# EAGLE design SenseThermo TEC - CR2ERP (EAGLE 9.3.2)
LICENSE: CERN OHL v1.2; REV: CR2ERP; TITLE: SenseTemp TEC; URL: https://github.com/CapableRobot/SenseTemp-TEC

## Sheet 1 of 4
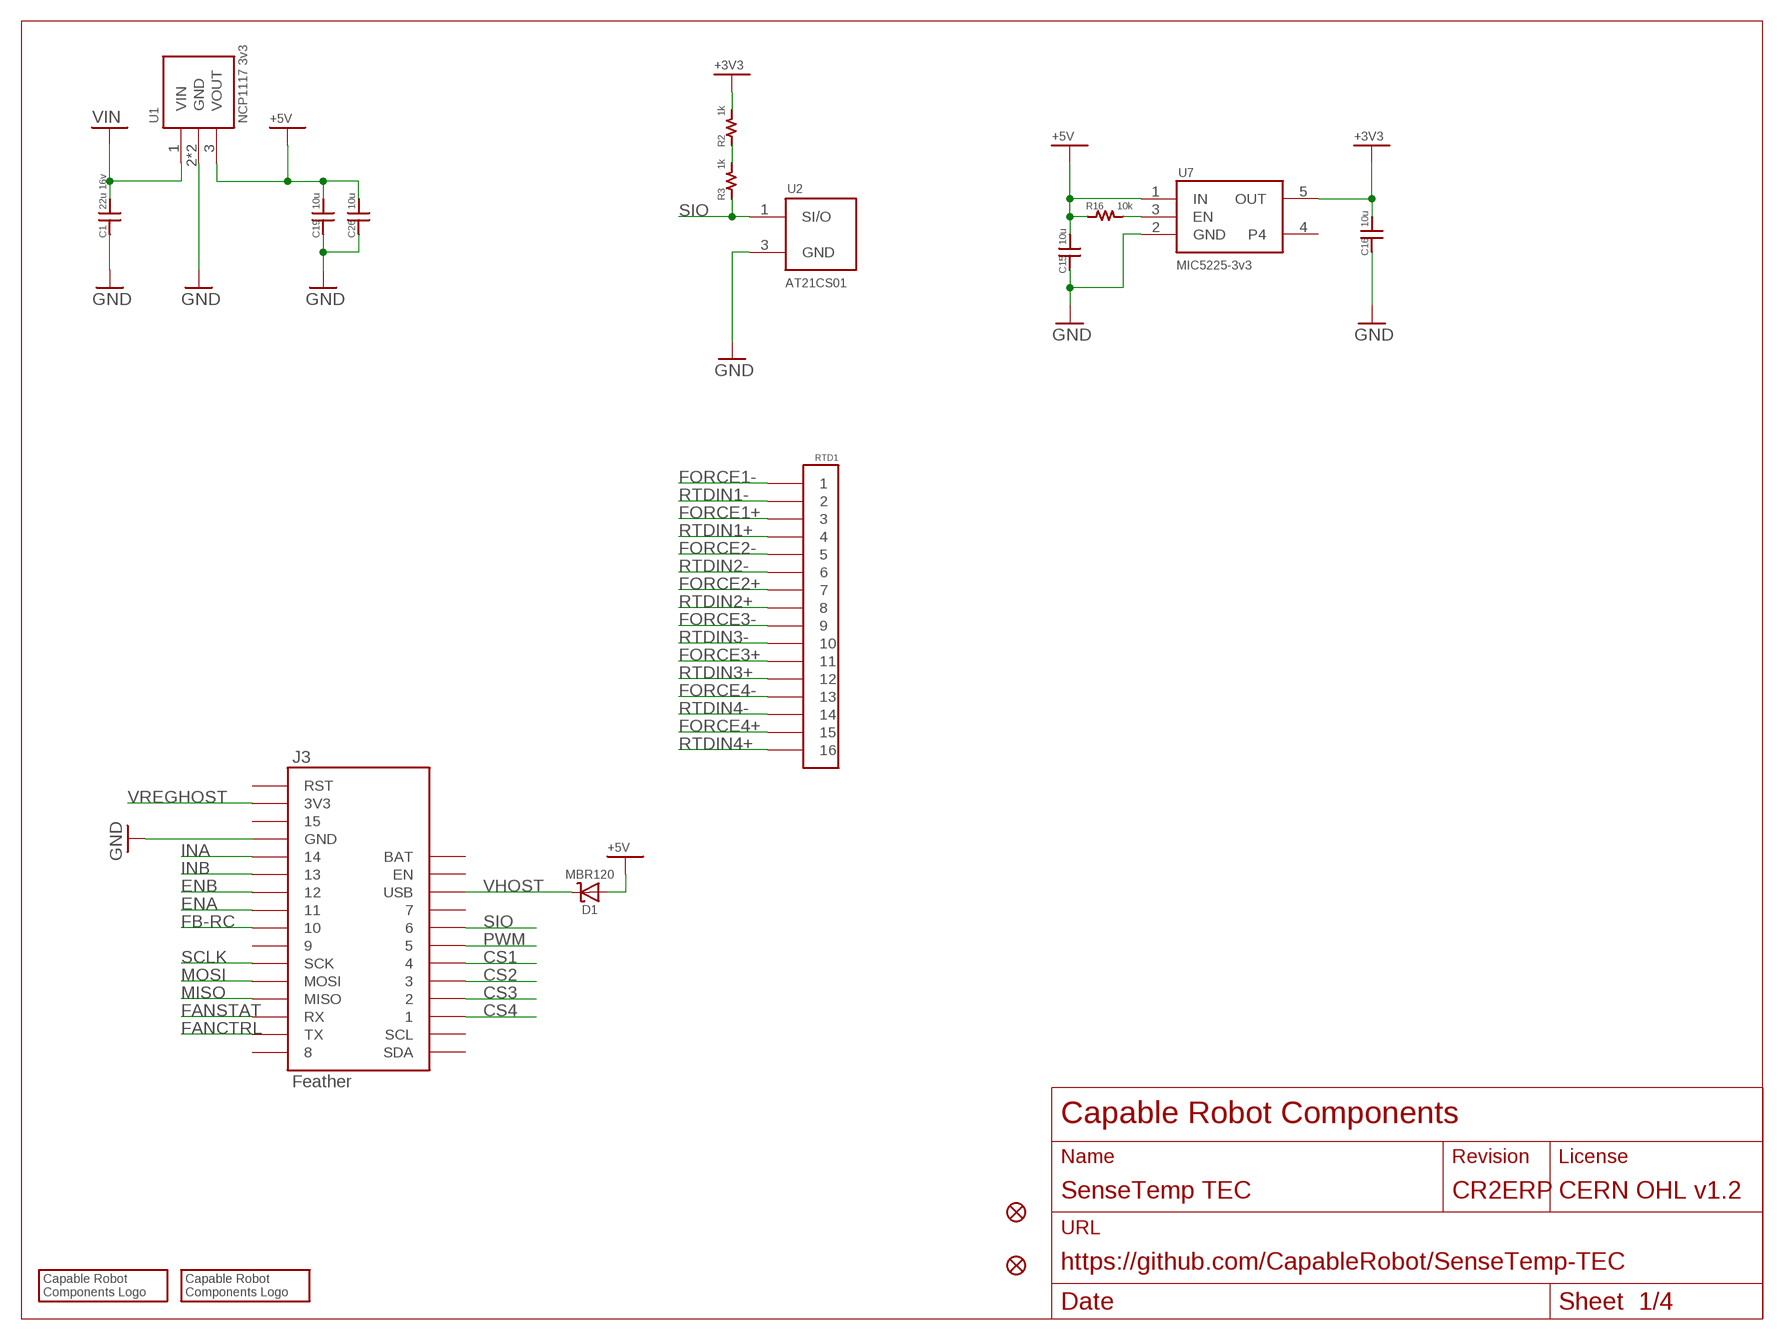
[diagram p0: schematic, sheet 1]

### Parts
C1  22u 16v  CAP1206  [1206]
C15  10u  CAP0805  [0805]
C16  10u  CAP0805  [0805]
C19  10u  CAP0805  [0805]
C26  10u  CAP0805  [0805]
D1  MBR120  DIODE-SCHOTTKYSOD-123  [SOD-123]
FID1  FIDUCIAL""  [FIDUCIAL_1MM]
FID2  FIDUCIAL""  [FIDUCIAL_1MM]
J3  FEATHERPTH  [FEATHER-PTH]
LOGO1  CRC-LOGO7SILK  [CRC-LOGO-7-SILK]
LOGO2  CRC-LOGO5  [CRC-LOGO-5]
R2  1k  RES0603  [0603]
R3  1k  RES0603  [0603]
R16  10k  RES0603  [0603]
RTD1  CONN-16ZT  [CONN-2X8-050-SMT-ZT]
U1  NCP1117 3v3  VREG-LDO  [SOT230P700X180-4]
U2  AT21CS01  [SOT23]
U7  3v3  MIC5225  [SOT25]

### Nets
+3V3: C16.P$2 R2.2 U7.5(OUT) ; also sheet 2,3
+5V: C15.P$2 C19.P$2 C26.P$2 D1.A R16.1 U1.3(VOUT) U7.1(IN)
CS1: J3.4 ; also sheet 2
CS2: J3.3 ; also sheet 2
CS3: J3.2 ; also sheet 3
CS4: J3.1 ; also sheet 3
ENA: J3.11 ; also sheet 4
ENB: J3.12 ; also sheet 4
FANCTRL: J3.TX ; also sheet 4
FANSTAT: J3.RX ; also sheet 4
FB-RC: J3.10 ; also sheet 4
FORCE1+: RTD1.3 ; also sheet 2
FORCE1-: RTD1.1 ; also sheet 2
FORCE2+: RTD1.7 ; also sheet 2
FORCE2-: RTD1.5 ; also sheet 2
FORCE3+: RTD1.11 ; also sheet 3
FORCE3-: RTD1.9 ; also sheet 3
FORCE4+: RTD1.15 ; also sheet 3
FORCE4-: RTD1.13 ; also sheet 3
GND: C1.P$1 C15.P$1 C16.P$1 C19.P$1 C26.P$1 J3.GND U1.2(GND) U1.4(GND) U2.3(GND) U7.2(GND) ; also sheet 2,3,4
INA: J3.14 ; also sheet 4
INB: J3.13 ; also sheet 4
MISO: J3.MISO ; also sheet 2,3
MOSI: J3.MOSI ; also sheet 2,3
N$4: R2.1 R3.2
N$20: R16.2 U7.3(EN)
PWM: J3.5 ; also sheet 4
RTDIN1+: RTD1.4 ; also sheet 2
RTDIN1-: RTD1.2 ; also sheet 2
RTDIN2+: RTD1.8 ; also sheet 2
RTDIN2-: RTD1.6 ; also sheet 2
RTDIN3+: RTD1.12 ; also sheet 3
RTDIN3-: RTD1.10 ; also sheet 3
RTDIN4+: RTD1.16 ; also sheet 3
RTDIN4-: RTD1.14 ; also sheet 3
SCLK: J3.SCK ; also sheet 2,3
SIO: J3.6 R3.1 U2.1(SI/O)
VHOST: D1.C J3.USB
VIN: C1.P$2 U1.1(VIN) ; also sheet 4
VREGHOST: J3.3V3 ; also sheet 4
Unconnected: J3.7 J3.8 J3.9 J3.15 J3.BAT J3.EN J3.RST J3.SCL J3.SDA U7.4

## Sheet 2 of 4
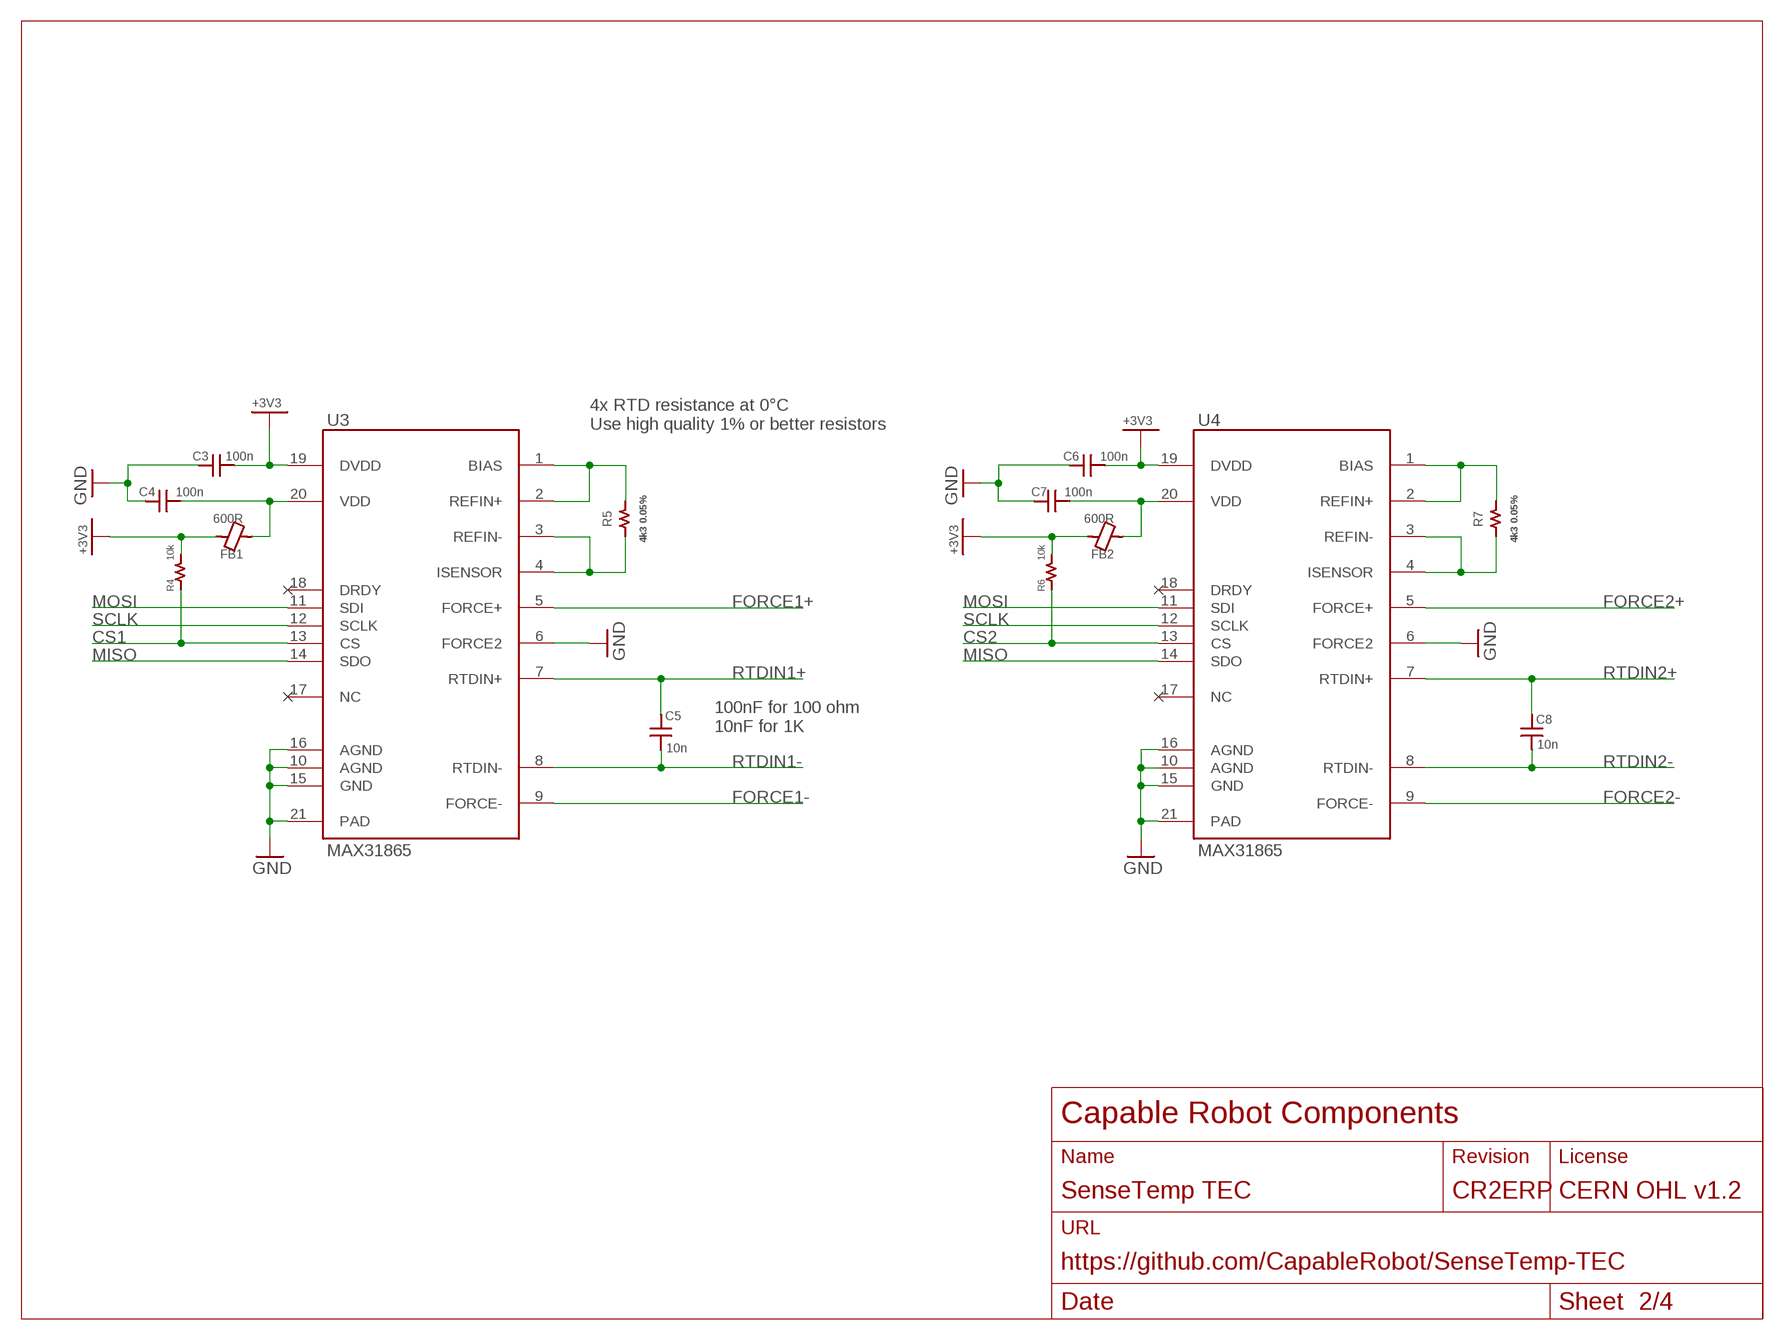
[diagram p1: schematic, sheet 2]

### Parts
C3  100n  CAP0603  [0603]
C4  100n  CAP0603  [0603]
C5  10n  CAP0603  [0603]
C6  100n  CAP0603  [0603]
C7  100n  CAP0603  [0603]
C8  10n  CAP0603  [0603]
FB1  600R  FER0603  [0603]
FB2  600R  FER0603  [0603]
R4  10k  RES0603  [0603]
R5  4k3 0.05%  RES0603  [0603]
R6  10k  RES0603  [0603]
R7  4k3 0.05%  RES0603  [0603]
U3  MAX31865  [QFN65P500X500X100-21T325]
U4  MAX31865  [QFN65P500X500X100-21T325]

### Nets
+3V3: C3.1 C6.1 FB1.2 FB2.2 R4.2 R6.2 U3.19(DVDD) U4.19(DVDD) ; also sheet 1,3
CS1: R4.1 U3.13(CS) ; also sheet 1
CS2: R6.1 U4.13(CS) ; also sheet 1
FORCE1+: U3.5(FORCE+) ; also sheet 1
FORCE1-: U3.9(FORCE-) ; also sheet 1
FORCE2+: U4.5(FORCE+) ; also sheet 1
FORCE2-: U4.9(FORCE-) ; also sheet 1
GND: C3.2 C4.2 C6.2 C7.2 U3.6(FORCE2) U3.10(AGND) U3.15(GND) U3.16(AGND) U3.21(PAD) U4.6(FORCE2) U4.10(AGND) U4.15(GND) U4.16(AGND) U4.21(PAD) ; also sheet 1,3,4
MISO: U3.14(SDO) U4.14(SDO) ; also sheet 1,3
MOSI: U3.11(SDI) U4.11(SDI) ; also sheet 1,3
N$5: R5.2 U3.1(BIAS) U3.2(REFIN+)
N$6: R5.1 U3.3(REFIN-) U3.4(ISENSOR)
N$7: C4.1 FB1.1 U3.20(VDD)
N$8: R7.2 U4.1(BIAS) U4.2(REFIN+)
N$9: R7.1 U4.3(REFIN-) U4.4(ISENSOR)
N$10: C7.1 FB2.1 U4.20(VDD)
RTDIN1+: C5.1 U3.7(RTDIN+) ; also sheet 1
RTDIN1-: C5.2 U3.8(RTDIN-) ; also sheet 1
RTDIN2+: C8.1 U4.7(RTDIN+) ; also sheet 1
RTDIN2-: C8.2 U4.8(RTDIN-) ; also sheet 1
SCLK: U3.12(SCLK) U4.12(SCLK) ; also sheet 1,3
Unconnected: U3.17(NC) U3.18(DRDY) U4.17(NC) U4.18(DRDY)

### Notes on the sheet
- 4x RTD resistance at 0°C 
  Use high quality 1% or better resistors
- 100nF for 100 ohm
  10nF for 1K

## Sheet 3 of 4
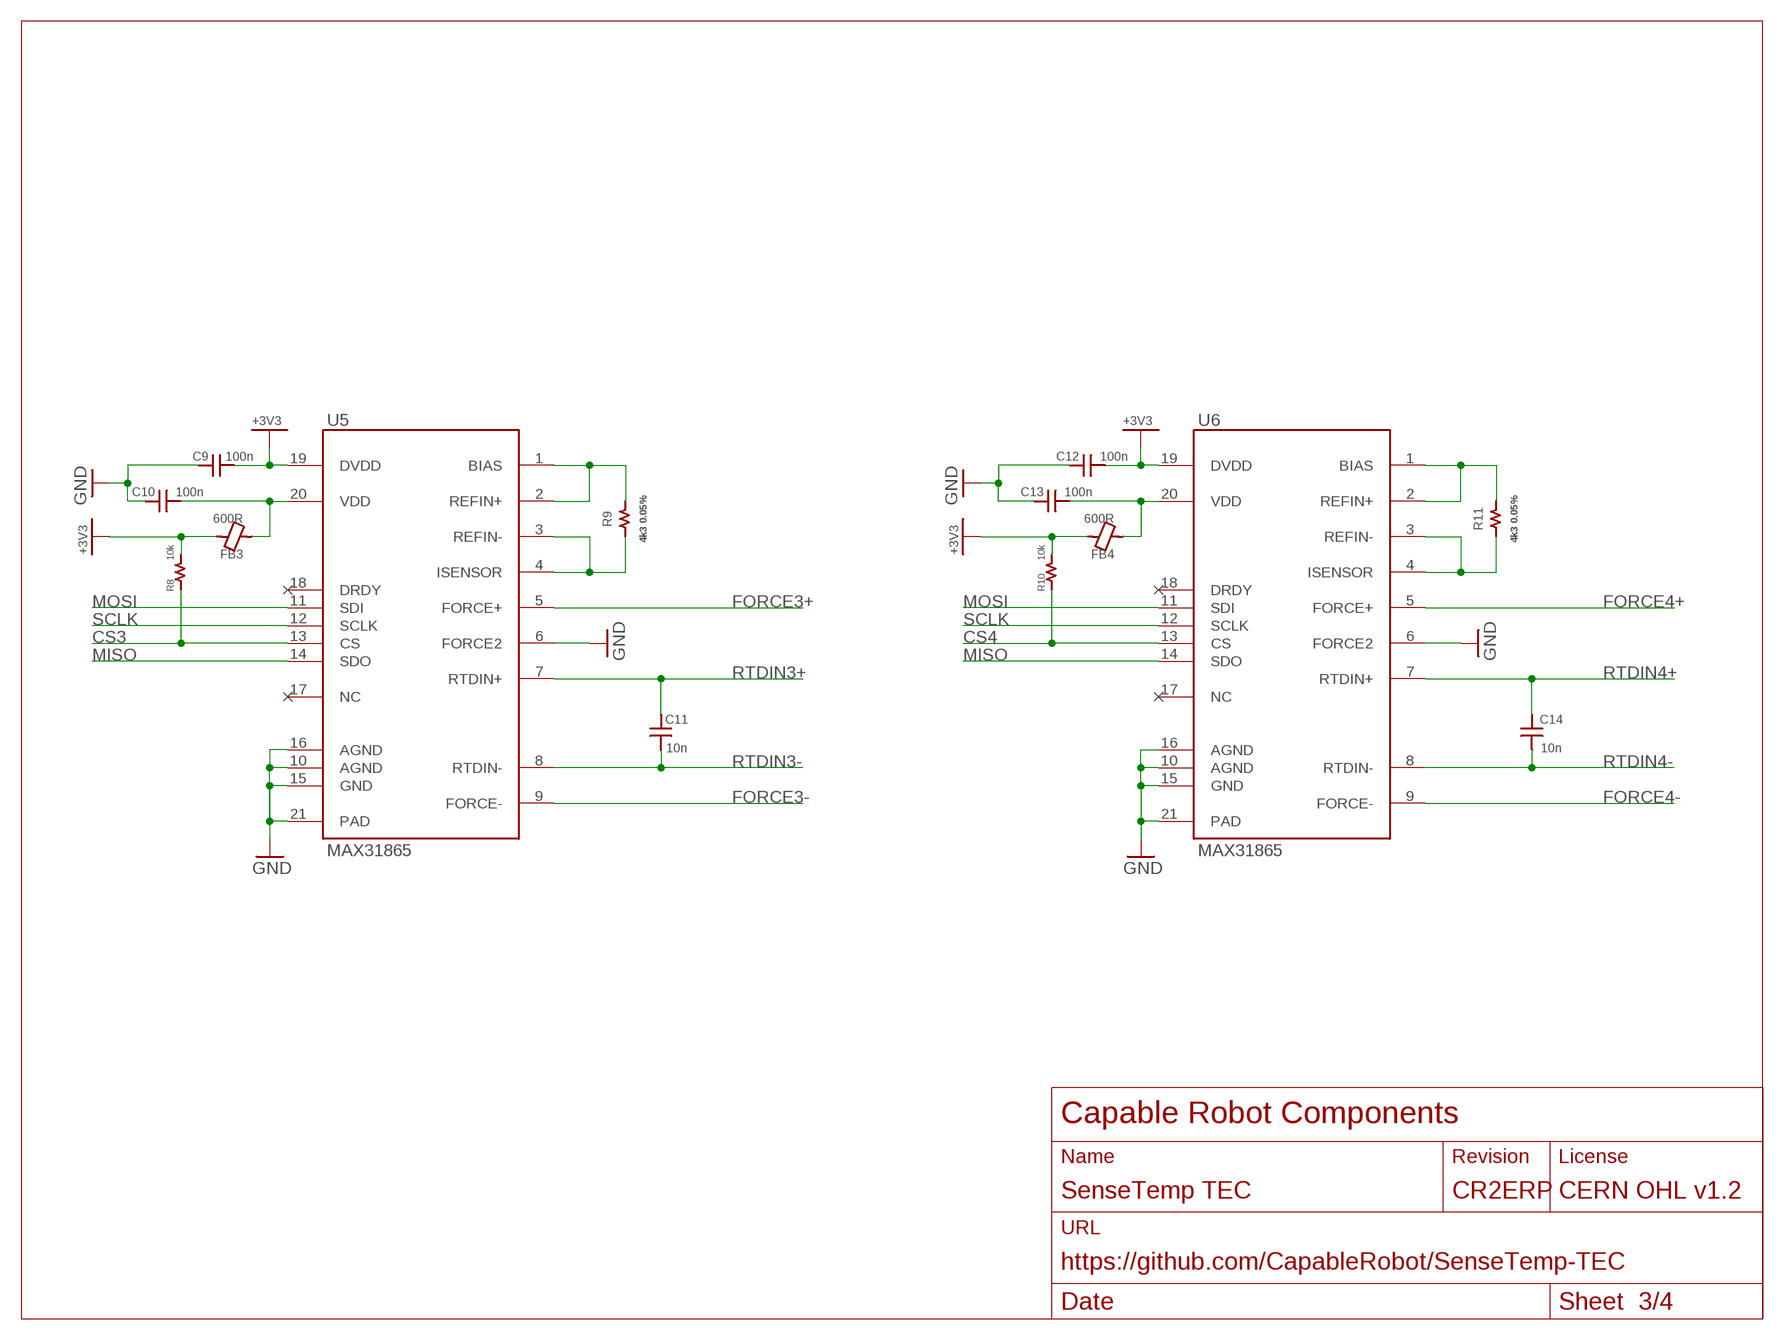
[diagram p2: schematic, sheet 3]

### Parts
C9  100n  CAP0603  [0603]
C10  100n  CAP0603  [0603]
C11  10n  CAP0603  [0603]
C12  100n  CAP0603  [0603]
C13  100n  CAP0603  [0603]
C14  10n  CAP0603  [0603]
FB3  600R  FER0603  [0603]
FB4  600R  FER0603  [0603]
R8  10k  RES0603  [0603]
R9  4k3 0.05%  RES0603  [0603]
R10  10k  RES0603  [0603]
R11  4k3 0.05%  RES0603  [0603]
U5  MAX31865  [QFN65P500X500X100-21T325]
U6  MAX31865  [QFN65P500X500X100-21T325]

### Nets
+3V3: C9.1 C12.1 FB3.2 FB4.2 R8.2 R10.2 U5.19(DVDD) U6.19(DVDD) ; also sheet 1,2
CS3: R8.1 U5.13(CS) ; also sheet 1
CS4: R10.1 U6.13(CS) ; also sheet 1
FORCE3+: U5.5(FORCE+) ; also sheet 1
FORCE3-: U5.9(FORCE-) ; also sheet 1
FORCE4+: U6.5(FORCE+) ; also sheet 1
FORCE4-: U6.9(FORCE-) ; also sheet 1
GND: C9.2 C10.2 C12.2 C13.2 U5.6(FORCE2) U5.10(AGND) U5.15(GND) U5.16(AGND) U5.21(PAD) U6.6(FORCE2) U6.10(AGND) U6.15(GND) U6.16(AGND) U6.21(PAD) ; also sheet 1,2,4
MISO: U5.14(SDO) U6.14(SDO) ; also sheet 1,2
MOSI: U5.11(SDI) U6.11(SDI) ; also sheet 1,2
N$11: R9.2 U5.1(BIAS) U5.2(REFIN+)
N$12: R9.1 U5.3(REFIN-) U5.4(ISENSOR)
N$13: C10.1 FB3.1 U5.20(VDD)
N$14: R11.2 U6.1(BIAS) U6.2(REFIN+)
N$15: R11.1 U6.3(REFIN-) U6.4(ISENSOR)
N$16: C13.1 FB4.1 U6.20(VDD)
RTDIN3+: C11.1 U5.7(RTDIN+) ; also sheet 1
RTDIN3-: C11.2 U5.8(RTDIN-) ; also sheet 1
RTDIN4+: C14.1 U6.7(RTDIN+) ; also sheet 1
RTDIN4-: C14.2 U6.8(RTDIN-) ; also sheet 1
SCLK: U5.12(SCLK) U6.12(SCLK) ; also sheet 1,2
Unconnected: U5.17(NC) U5.18(DRDY) U6.17(NC) U6.18(DRDY)

## Sheet 4 of 4
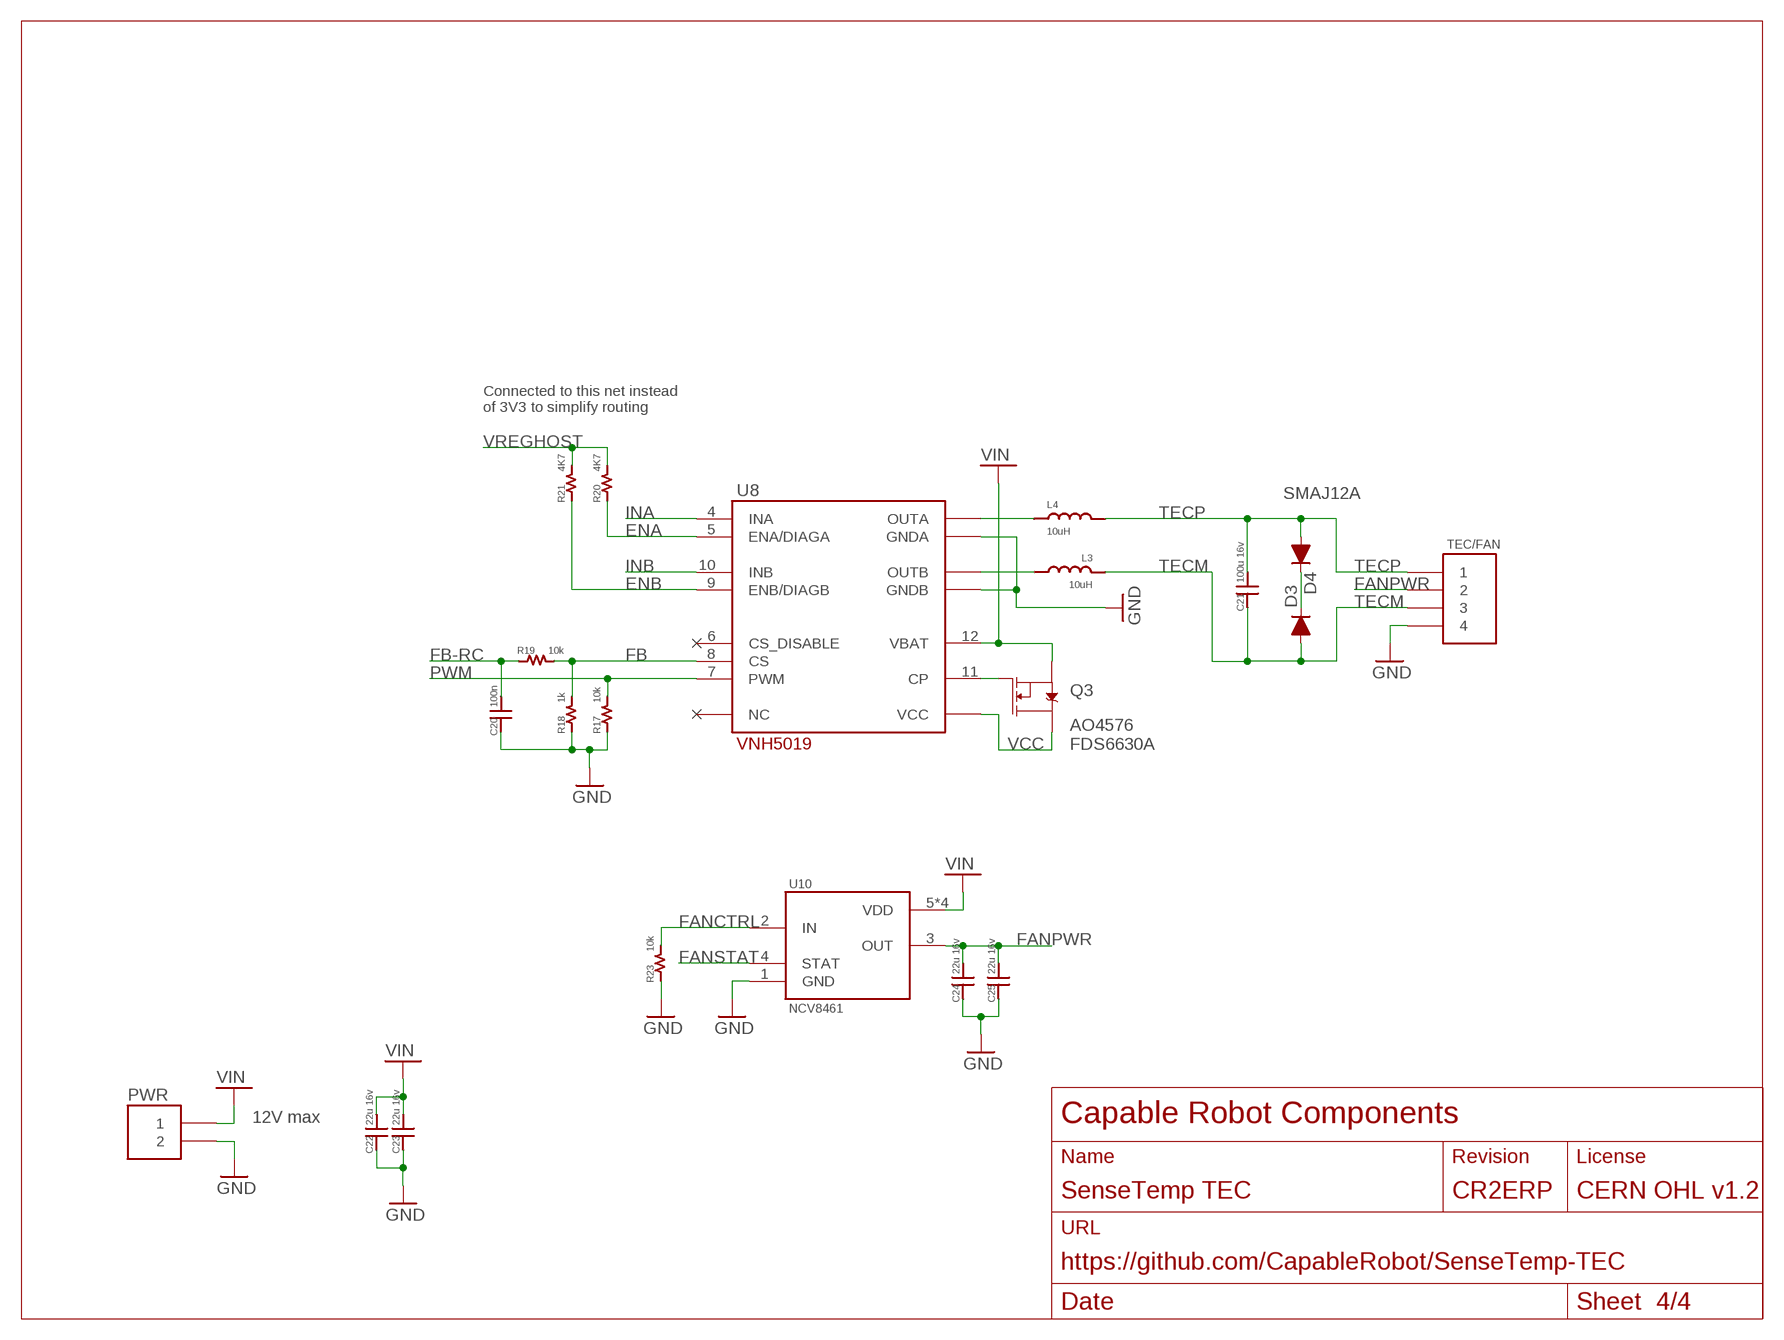
[diagram p3: schematic, sheet 4]

### Parts
C20  100n  CAP0603  [0603]
C21  100u 16v  CAP2220  [2220]
C22  22u 16v  CAP1206  [1206]
C23  22u 16v  CAP1206  [1206]
C24  22u 16v  CAP1206  [1206]
C25  22u 16v  CAP1206  [1206]
D3  SMAJ12A  DIODEDO214AA  [DO214AA]
D4  SMAJ12A  DIODEDO214AA  [DO214AA]
L3  10uH  INDHCF1007  [IND-HCF1007]
L4  10uH  INDHCF1007  [IND-HCF1007]
PWR  CONN-2-MFJR-RA  [CONN-MFJR-RA-2X1]
Q3  6.5A/30V/38mΩ  MOSFET-NCH-SOIC8  [SOIC127P600X175-8]
R17  10k  RES0603  [0603]
R18  1k  RES0603  [0603]
R19  10k  RES0603  [0603]
R20  4K7  RES0603  [0603]
R21  4K7  RES0603  [0603]
R23  10k  RES0603  [0603]
TEC/FAN  CONN-4-MFJR-RA  [CONN-MFJR-RA-2X2]
U8  VNH5019  [SOP100P1900X235-30-EP]
U10  NCV8461  [SOIC127P600X175-8]

### Nets
CP1: Q3.4(G) U8.11(CP)
ENA: R20.1 U8.5(ENA/DIAGA) ; also sheet 1
ENB: R21.1 U8.9(ENB/DIAGB) ; also sheet 1
FANCTRL: R23.2 U10.2(IN) ; also sheet 1
FANPWR: C24.P$2 C25.P$2 TEC/FAN.2 U10.3(OUT)
FANSTAT: U10.4(STAT) ; also sheet 1
FB: R18.2 R19.2 U8.8(CS)
FB-RC: C20.2 R19.1 ; also sheet 1
GND: C20.1 C22.P$1 C23.P$1 C24.P$1 C25.P$1 PWR.2 R17.1 R18.1 R23.1 TEC/FAN.4 U8.18(GNDB) U8.19(GNDB) U8.20(GNDB) U8.26(GNDA) U8.27(GNDA) U8.28(GNDA) U10.1(GND) ; also sheet 1,2,3
INA: U8.4(INA) ; also sheet 1
INB: U8.10(INB) ; also sheet 1
OUTA1: L4.1 U8.1(OUTA) U8.25(OUTA) U8.30(OUTA) U8.OUTA
OUTB1: L3.2 U8.15(OUTB) U8.16(OUTB) U8.21(OUTB) U8.OUTB
PWM: R17.2 U8.7(PWM) ; also sheet 1
SNUB1: D3.C D4.C
TECM: C21.1 D3.A L3.1 TEC/FAN.3
TECP: C21.2 D4.A L4.2 TEC/FAN.1
VCC: Q3.5(D) Q3.6(D) Q3.7(D) Q3.8(D) U8.3(VCC) U8.13(VCC) U8.23(VCC) U8.VCC
VIN: C22.P$2 C23.P$2 PWR.1 Q3.1(S) Q3.2(S) Q3.3(S) U8.12(VBAT) U10.5(VDD) U10.6(VDD) U10.7(VDD) U10.8(VDD) ; also sheet 1
VREGHOST: R20.2 R21.2 ; also sheet 1
Unconnected: U8.2(NC) U8.6(CS_DISABLE) U8.14(NC) U8.17(NC) U8.22(NC) U8.24(NC) U8.29(NC)

### Notes on the sheet
- Connected to this net instead 
  of 3V3 to simplify routing
- AO4576
  FDS6630A
- 12V max

## Library data of the parts
C1 C3-C16 C19-C26 = CapableRobot:CAP
D1 = Adafruit Feather M0 Express:DIODE-SCHOTTKY; MPN: MBR120VLSFT3G
D3 D4 = EEZ MyLib7:DIODE; MPN: SMAJ12A-13-F
FB1-FB4 = CapableRobot:FER: Ferrite
FID1 FID2 = microbuilder:FIDUCIAL: Fiducial Alignment Points Various fiducial points for machine vision alignment.
J3 = CapableRobot:FEATHER
L3 L4 = CapableRobot:IND: Shielded Power Inductor 1212 - Bourns SRFN03500145 1212 - Murata LQH3N SRN4018 - Bourns (4 x 4 x 2) MSS5131 - Coilcraft MSS5131 (5.1 x 5.1 x 3.1) SD53 - Cooper Ind SD53 (5.2 x 5.2 x 3.0) octagonal
LOGO1 LOGO2 = CapableRobot:CRC-LOGO
PWR = CapableRobot:CONN-2
Q3 = CapableRobot:MOSFET-NCH: MOSFET-NCH FDS6630A : 6.5A / 30V / SOIC8; MPN: FDS6630A
R2-R11 R16-R21 R23 = CapableRobot:RES
RTD1 = CapableRobot:CONN-16; MPN: 3221-16-0300-00
TEC/FAN = CapableRobot:CONN-4
U1 = CapableRobot:VREG-LDO; MPN: NCP1117ST50T3G
U2 = CapableRobot:AT21CS01: Single-Wire, I/O Powered 1-Kbit (128 x 8) Serial EEPROM with a Unique, Factory-Programmed 64-Bit Serial Number
U3-U6 = CapableRobot:MAX31865: RTD-to-Digital Converter
U7 = CapableRobot:MIC5225: Ultra-Low Quiescent Current 150mA Low Dropout Regulator
U8 = CapableRobot:VNH5019
U10 = CapableRobot:NCV8461: Self Protected High Side Driver with Temperature Shutdown and Current Limit; MPN: NCV8461DR2G

## Board
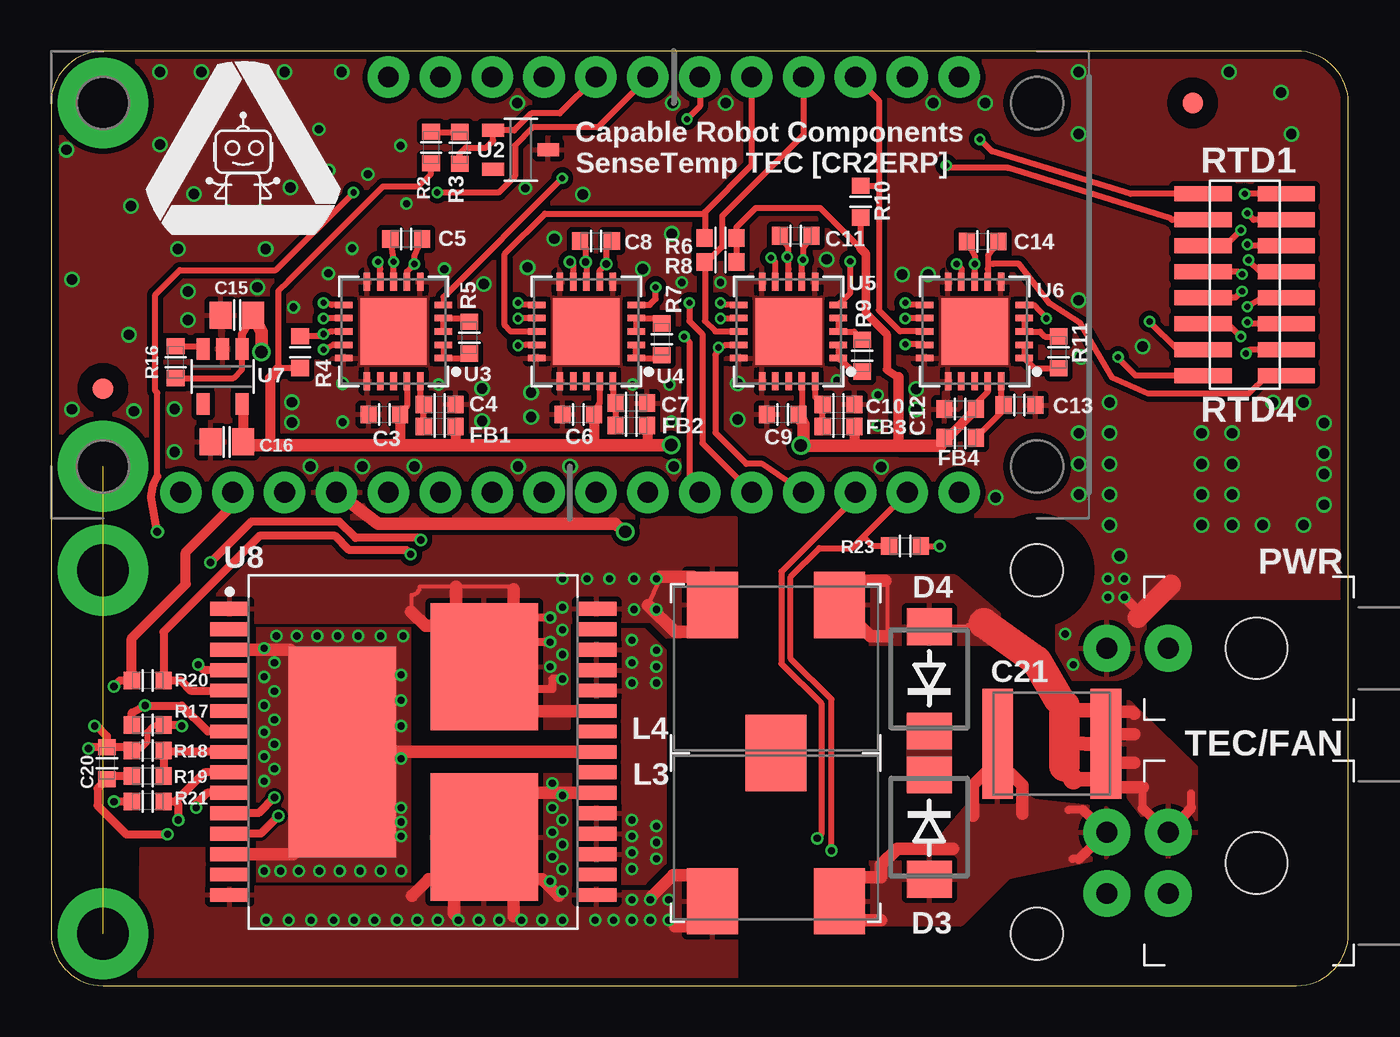
[diagram p4: board, top side]
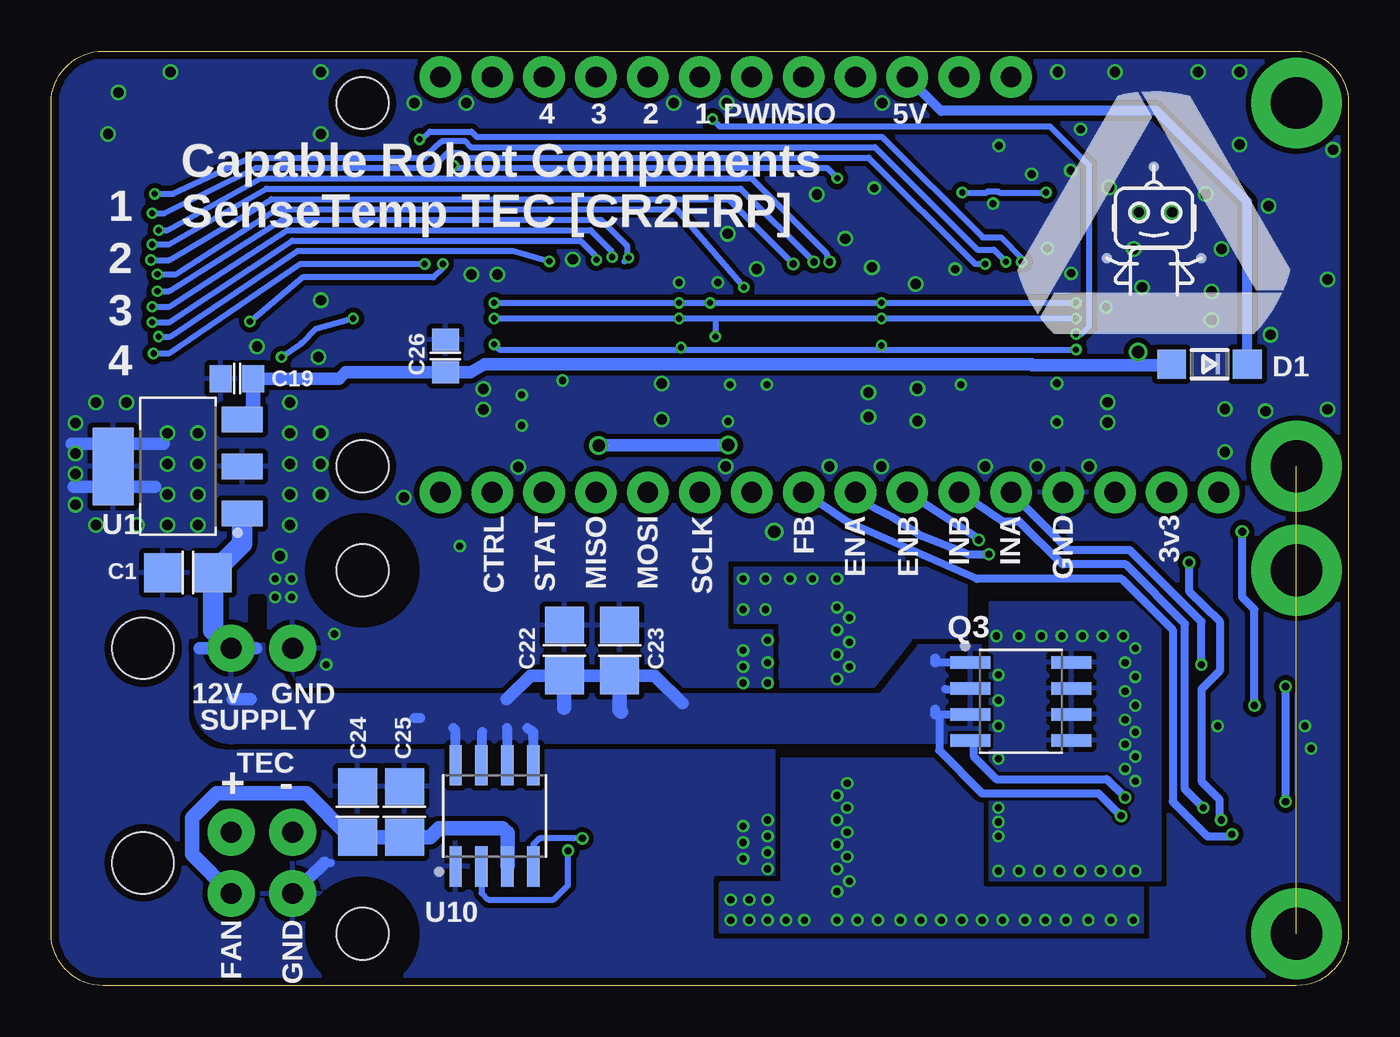
[diagram p5: board, bottom side, seen from below]

Size 63.5 x 45.72 mm. Coordinates in mm from the lower left corner, seen from the top.
Outline: 0,43.18 0,2.54 arc90 2.54,0 60.96,0 arc90 63.5,2.54 63.5,43.18 arc90 60.96,45.72 2.54,45.72 arc90 0,43.18
Copper layers (1*16): Top 0.035559375mm / dielectric 1.6mm / Bottom 0.035559375mm
Design rules "oshpark-2layer-tented *": minimum track width 6mil, minimum drill 10mil, track to track 6mil, track to pad 6mil, pad to pad 6mil, via to via 6mil, smd to smd 6mil, copper to edge 15mil, drill to drill 6mil, minimum pad ring 5mil, minimum via ring 5mil, stop-mask expansion 2.5mil, vias tented up to drill 25mil, thermal gap 10mil
Holes 2.54 mm at 48.26,25.4 48.26,43.18 48.26,2.54 48.26,20.32
tRestrict: area 45.7,17.8 to 50.8,22.9; area 45.7,0 to 50.8,5.1
bRestrict: area 45.7,0 to 50.8,5.1; area 45.7,17.8 to 50.8,22.9; area 53.2,17.4 to 53.6,18.9

### Footprints (pad centres in the part's own frame; a part is rotated, then mirrored left to right if it is on the bottom)
1206 = smd 1.803 x 1.918: P$1 -1.238,0; P$2 1.238,0
0603 = smd 0.79 x 0.86: 1 -0.775,0; 2 0.775,0
0805 = smd 1.079 x 1.321: P$1 -0.794,0; P$2 0.794,0
2220 = smd 1.5 x 5.4: 1 -2.65,0; 2 2.65,0
SOD-123 = smd 1.4 x 1.4: A 1.85,0; C -1.85,0
DO214AA = smd 1.8 x 2.2: A 2.55,0; C -2.55,0
FIDUCIAL_1MM = smd 1 x 1: 1 0,0
FEATHER-PTH = drill 1.016 pad 2.032: 1 39.37,21.59; 2 36.83,21.59; 3 34.29,21.59; 3V3 8.89,1.27; 4 31.75,21.59; 5 29.21,21.59; 6 26.67,21.59; 7 24.13,21.59; 8 44.45,1.27; 9 29.21,1.27; 10 26.67,1.27; 11 24.13,1.27; 12 21.59,1.27; 13 19.05,1.27; 14 16.51,1.27; 15 11.43,1.27; BAT 16.51,21.59; EN 19.05,21.59; GND 13.97,1.27; MISO 36.83,1.27; MOSI 34.29,1.27; RST 6.35,1.27; RX 39.37,1.27; SCK 31.75,1.27; SCL 41.91,21.59; SDA 44.45,21.59; TX 41.91,1.27; USB 21.59,21.59
IND-HCF1007 = smd 3.25 x 2.5: 1 -3.125,-3.1; 2 -3.125,3.1 | smd 2.5 x 3: P$1 3.5,0
CONN-MFJR-RA-2X1 = drill 1.02 pad 2.286: 1 0,4.32; 2 0,7.32 | hole 3: 0,0
SOIC127P600X175-8 = smd 1.968 x 0.602: 1 -2.473,1.905; 2 -2.473,0.635; 3 -2.473,-0.635; 4 -2.473,-1.905; 5 2.473,-1.905; 6 2.473,-0.635; 7 2.473,0.635; 8 2.473,1.905
CONN-2X8-050-SMT-ZT = smd 0.737 x 2.794: 1 4.445,2.032; 2 4.445,-2.032; 3 3.175,2.032; 4 3.175,-2.032; 5 1.905,2.032; 6 1.905,-2.032; 7 0.635,2.032; 8 0.635,-2.032; 9 -0.635,2.032; 10 -0.635,-2.032; 11 -1.905,2.032; 12 -1.905,-2.032; 13 -3.175,2.032; 14 -3.175,-2.032; 15 -4.445,2.032; 16 -4.445,-2.032
CONN-MFJR-RA-2X2 = drill 1.02 pad 2.286: 1 1.5,4.32; 2 -1.5,4.32; 3 1.5,7.32; 4 -1.5,7.32 | hole 3: 0,0
SOT230P700X180-4 = smd 2 x 1.25: 1 -3.15,2.3; 2 -3.15,0; 3 -3.15,-2.3 | smd 2 x 3.8: 4 3.15,0
SOT23 = smd 0.635 x 1.067: 1 0.95,1.346; 2 -0.95,1.346; 3 0,-1.346
QFN65P500X500X100-21T325 = smd 0.86 x 0.32: 1 -2.435,1.3; 2 -2.435,0.65; 3 -2.435,0; 4 -2.435,-0.65; 5 -2.435,-1.3; 11 2.435,-1.3; 12 2.435,-0.65; 13 2.435,0; 14 2.435,0.65; 15 2.435,1.3 | smd 0.32 x 0.86: 6 -1.3,-2.435; 7 -0.65,-2.435; 8 0,-2.435; 9 0.65,-2.435; 10 1.3,-2.435; 16 1.3,2.435; 17 0.65,2.435; 18 0,2.435; 19 -0.65,2.435; 20 -1.3,2.435 | smd 3.25 x 3.25: 21 0,0
SOT25 = smd 0.635 x 1.067: 1 -0.95,-1.346; 2 0,-1.346; 3 0.95,-1.346; 4 0.95,1.346; 5 -0.95,1.346
SOP100P1900X235-30-EP = smd 1.91 x 0.675: 1 -8.98,7; 2 -8.98,6; 3 -8.98,5; 4 -8.98,4; 5 -8.98,3; 6 -8.98,2; 7 -8.98,1; 8 -8.98,0; 9 -8.98,-1; 10 -8.98,-2; 11 -8.98,-3; 12 -8.98,-4; 13 -8.98,-5; 14 -8.98,-6; 15 -8.98,-7; 16 8.98,-7; 17 8.98,-6; 18 8.98,-5; 19 8.98,-4; 20 8.98,-3; 21 8.98,-2; 22 8.98,-1; 23 8.98,0; 24 8.98,1; 25 8.98,2; 26 8.98,3; 27 8.98,4; 28 8.98,5; 29 8.98,6; 30 8.98,7 | smd 5.25 x 6.23: OUTA 3.475,4.165; OUTB 3.475,-4.165 | smd 5.25 x 10.3: VCC -3.475,0

### Placement (x,y rotation side)
C1  56.8,20.2 0 bottom
C3  16.31,27.94 180 top
C4  19.02,28.43 0 top
C5  17.38,36.53 180 top
C6  25.81,27.94 180 top
C7  28.4,28.5 0 top
C8  26.67,36.43 180 top
C9  35.81,27.94 180 top
C10  38.54,28.43 0 top
C11  36.45,36.68 180 top
C12  44.5,28.2 180 top
C13  47.4,28.4 0 top
C14  45.59,36.4 180 top
C15  9.1,32.8 0 top
C16  8.6,26.6 0 top
C19  54.4,29.7 0 bottom
C20  2.73,10.88 270 top
C21  48.98,11.83 0 top
C22  38.37,16.4 270 bottom
C23  35.67,16.4 270 bottom
C24  48.5,8.5 270 bottom
C25  46.2,8.5 270 bottom
C26  44.2,30.8 270 bottom
D1  6.8,30.4 180 bottom
D3  42.98,7.75 270 top
D4  42.98,15 90 top
FB1  19.02,27.36 0 top
FB2  28.4,27.4 0 top
FB3  38.54,27.36 0 top
FB4  44.5,26.8 180 top
FID1  2.54,29.21 90 top
FID2  55.88,43.18 90 top
J3  0,22.86 0 top
L3  35.48,7.25 90 top
L4  35.48,15.5 270 top
LOGO1  9.52,36.82 0 bottom
LOGO2  9.4,40.26 0 top
PWR  59,16.5 90 top
Q3  16.03,13.9 0 bottom
R2  18.6,41 270 top
R3  20,40.98 90 top
R4  12.19,30.99 270 top
R5  20.47,31.7 270 top
R6  32.77,36.58 0 top
R7  29.9,31.62 270 top
R8  32.77,35.4 0 top
R9  39.7,30.82 270 top
R10  39.62,38.35 270 top
R11  49.32,30.98 270 top
R16  6.1,30.5 90 top
R17  4.73,12.75 180 top
R18  4.73,11.5 0 top
R19  4.73,10.25 0 top
R20  4.73,14.93 180 top
R21  4.73,9 180 top
R23  41.8,21.5 180 top
RTD1  58.42,34.29 90 top
TEC/FAN  59,6 90 top
U1  57.3,25.4 180 bottom
U2  22.99,40.89 90 top
U3  16.77,32 180 top
U4  26.2,32 180 top
U5  36.1,32 180 top
U6  45.2,32 180 top
U7  8.4,29.8 180 top
U8  17.73,11.43 0 top
U10  41.8,8.3 90 bottom

### Tracks (layer width: path | path; a pad name or v marks a point on that pad's centre or on a via)
+3V3  (via drill 0.61)
  Top 0.3: U3.19 17.41,28.35 C3.1 | U4.19 26.85,28.51 C6.1 | U5.19 36.75,28.02 C9.1 | 15.94,38.8 16.24,39.1 18,39.1 18.6,39.7 R2.2 | 11.61,34.47 11.12,33.98 11.12,30.21 | U6.19 45.85,29.05 45.27,28.48 45.27,28.15 | 26.58,26.46 26.6,26.44 | 34.5,38.05 37.64,38.05 38.61,37.08
  Top 0.305: C6.1 26.81,27.99 | C3.1 17.11,27.99 | R6.2 33.49,36.63 | 38.61,37.08 39.62,36.07 R10.2 | 36.72,27.99 C9.1 36.57,27.93 | R4.2 11.12,30.21 | R6.2 R8.2 | R6.2 33.54,37.07 33.53,37.08 34.5,38.05 | 15.94,38.8 11.61,34.47
  Top 0.4: 41.48,29.76 40.9,30.14 40.9,31.87 39.88,32.89
  Top 0.406: 39.88,32.89 39.88,35.81 39.62,36.07
  Top 0.5: 11.12,30.21 10.72,29.71 10.72,26.44 | U7.5 9.39,28.41 C16.P$2 9.45,26.54 | 43.54,26.42 43.54,26.61 FB4.2 43.81,26.74 C12.1 45.27,28.15 | FB3.2 39.32,26.4 40.4,26.42 | C6.1 26.58,26.46 | FB2.2 29.2,27.38 29.2,26.44 | FB1.2 19.79,26.45 19.8,26.44 | C3.1 17.09,26.46 17.1,26.44
  Top 0.508: 41.48,29.76 41.48,26.42
  Top 0.6: 9.4,26.44 9.45,26.54
  Top 0.61: v30.35,26.44 29.2,26.44 26.6,26.44 19.8,26.44 17.1,26.44 10.72,26.44 9.4,26.44 | 36.84,26.42 v36.7,26.42 36.76,26.48 | 36.84,26.42 40.4,26.42 41.48,26.42 43.54,26.42 | C9.1 36.84,27.47 36.84,26.42
  Bottom 0.61: v30.35,26.44 36.58,26.44 v36.7,26.42
+5V  (via drill 0.6)
  Top 0.3: R16.1 8.93,29.73 9.35,30.15 U7.1
  Top 0.4: U7.1 9.35,31.86 C15.P$2
  Top 0.6: v10.3,31 10.3,31.99 C15.P$2
  Bottom 0.6: C19.P$2 49.41,29.7 49.41,29.69 49.09,30.01 C26.P$2 42.96,30.01 42.28,30.4 15.5,30.4 15.46,30.36 10.4,30.36 | 10.4,30.36 8.69,30.36 D1.A | v10.3,31 10.3,30.46 10.4,30.36
  Bottom 0.7: C19.P$2 53.61,28.24 U1.3
CP1  (via drill 0.35)
  Top 0.4: U8.11 10.16,8.43 v10.93,9.2
  Bottom 0.3: 18.33,11.82 Q3.4
  Bottom 0.4: v10.93,9.2 11.83,10.1 17.23,10.1 18.33,11.2 18.33,11.82
CS1  (via drill 0.3)
  Top 0.3: U3.13 14.27,32 13.76,32
  Top 0.305: 13.76,32 v13.34,31.88 13.22,31.76 R4.1 | v31.13,42.39 31.75,43.02 J3.4
  Bottom 0.305: v13.34,31.88 13.08,31.88 12.7,32.26 12.7,40.13 14.61,42.04 30.77,42.04 v31.13,42.39
CS2
  Top 0.3: U4.13 22.5,32 22.2,32.3 22.2,35.8 24.17,37.77 31.93,37.77 32,37.85
  Top 0.305: 31.99,36.82 R6.1 32,36.59 32,37.85 34.29,40.13 J3.3
CS3
  Top 0.3: 32.51,32 U5.13
  Top 0.305: 32.51,32 32,32.51 32,35.31 | 32,35.31 32,35.41 R8.1 | J3.2 36.83,41.63 32.84,37.64 32.84,36.14 32,35.31
CS4
  Top 0.3: U6.13 41.56,32
  Top 0.305: 40.51,39.12 40.51,33.05 41.56,32 | R10.1 39.64,39.12 40.51,39.12 | J3.1 40.51,43.31 40.51,39.12
ENA  (via drill 0.35)
  Top 0.4: U8.5 6.83,14.43 6.33,14.93 R20.1 5.5,17.3 10.2,22 13.9,22 14.6,21.3 17.4,21.3 v17.6,21.1
  Bottom 0.4: v17.6,21.1 18.6,21.1 20.9,22 22.3,22.9 24.13,23.83 J3.11
ENB  (via drill 0.35)
  Top 0.4: U8.9 7.51,10.43 6.08,9 | 6.08,9 5.53,9 | 5.53,9 R21.1 | 5.53,9 | v7.8,20.7 9.8,22.7 14.1,22.7 14.9,21.9 18,21.9 v18.1,21.8 | 6.08,9 6.23,8.85 v6.23,8.1
  Bottom 0.4: J3.12 18.16,21.9 v18.1,21.8 | v6.23,8.1 6.33,8.2 6.33,9.13 7.2,10 7.2,14.5 6.3,15.4 6.3,17.83 7.8,19.3 v7.8,20.7
FANCTRL  (via drill 0.35)
  Top 0.3: v38.2,6.6 38.2,14 36.2,16 36.2,20 37.6,21.4 39.2,21.4 39.75,21.95 | J3.TX 41.91,24.11 39.75,21.95 | R23.2 40.2,21.5 39.75,21.95
  Bottom 0.3: U10.2 42.44,4.54 42.1,4.2 38.9,4.2 38.2,4.9 v38.2,6.6
FANPWR
  Bottom 0.7: U10.3 41.16,7.46 41.4,7.7 44.5,7.7 44.94,7.26 C25.P$2 C24.P$2 48.86,7.26 51,9.4 55.4,9.4 56.6,8.2 56.6,6.42 TEC/FAN.2
FANSTAT  (via drill 0.35)
  Top 0.3: J3.RX 39.37,23.87 35.75,20.25 35.75,15.75 37.7,13.8 37.7,7.4 v37.5,7.2
  Bottom 0.3: v37.5,7.2 37.95,7.2 39.6,7.2 39.9,6.91 U10.4
FB
  Top 0.4: U8.8 5.58,11.43 | 5.58,11.43 R18.2 | R19.2 5.5,11.36 5.58,11.43
FB-RC  (via drill 0.35)
  Top 0.4: R19.1 2.88,10.25 C20.2 2.28,9.65 2.28,8.8 3.68,7.4 v5.7,7.4
  Bottom 0.4: J3.10 24.54,22.7 18.2,19.9 11.1,19.9 8.6,17.4 8.6,9 6.9,7.3 5.8,7.3 v5.7,7.4
FORCE1+  (via drill 0.3)
  Top 0.3: 19.2,33.68 U3.5
  Top 0.305: v25.02,39.5 19.2,33.68 | v43.81,40.13 43.94,40.01 46.82,40.01 54.77,37.54 54.86,37.47 RTD1.3
  Bottom 0.305: v25.02,39.5 25.53,40.01 43.69,40.01 v43.81,40.13
FORCE1-  (via drill 0.3)
  Top 0.3: U3.9 16.11,35.07 16.11,35.27
  Top 0.305: 16.11,35.27 v16,35.41 | RTD1.1 52.83,38.73 46.06,40.81 v45.47,41.4
  Bottom 0.305: v16,35.41 16,35.61 17,36.6 17.9,36.6 22.82,41.53 42.67,41.53 42.93,41.78 44.96,41.78 45.34,41.4 v45.47,41.4
FORCE2+  (via drill 0.3)
  Top 0.3: U4.5 29.3,33.3 29.59,33.59 v29.59,34.16
  Top 0.305: v58.29,34.8 58.1,34.92 RTD1.7
  Bottom 0.305: v29.59,34.16 32.89,37.97 52.45,37.97 57.4,34.8 v58.29,34.8
FORCE2-  (via drill 0.3, 0.36)
  Top 0.3: v25.4,35.41 25.55,35.26 U4.9
  Top 0.305: 25.51,35.29 v25.4,35.41 | RTD1.5 57.47,36.2 v58.23,36.96
  Bottom 0.305: v25.4,35.41 25.53,35.53 25.53,35.81 29.21,39.5 53.21,39.5 57.78,36.96 v58.23,36.96
FORCE3+  (via drill 0.3)
  Top 0.3: U5.5 39.12,33.88 v39.12,35.43
  Top 0.305: v58.23,31.75 57.59,32.38 RTD1.11
  Bottom 0.305: v39.12,35.43 40.89,35.94 51.44,35.94 57.66,31.75 v58.23,31.75
FORCE3-  (via drill 0.3)
  Top 0.3: U5.9 35.45,35.39 v35.23,35.61
  Top 0.305: v58.29,33.97 57.98,33.66 RTD1.9
  Bottom 0.305: v35.23,35.61 35.43,35.43 35.31,35.56 35.31,36.2 36.58,37.47 52.2,37.47 57.72,33.97 v58.29,33.97
FORCE4+  (via drill 0.3)
  Top 0.305: v48.71,32.64 48.1,33.3 U6.5 | RTD1.15 53.09,29.84 52.22,30.71 v52.22,30.75
  Bottom 0.305: v48.71,32.64 50.55,32.13 51.24,31.43 52.23,30.75 v52.22,30.75
FORCE4-  (via drill 0.3)
  Top 0.3: 44.56,35.07 44.55,35.05 U6.9
  Top 0.305: v44.32,35.31 44.56,35.07 | v53.77,32.49 55.14,31.11 RTD1.13
  Bottom 0.305: v44.32,35.31 44.32,35.11 44.78,34.64 51.18,34.64 v53.77,32.49
GND  (via drill 0.35, 0.36, 0.38, 0.4, 0.51, 0.6)
  Top 0.3: R18.1 4.05,11.6 4.4,11.6 4.7,11.9 4.7,12.4 5,12.7 5.46,12.7 R17.1 | R23.1 v43.5,21.5
  Top 0.305: C6.2 24.86,28.04 | C12.2 43.91,28.04
  Top 0.4: C20.1 3.81,11.65 R18.1 | C20.1 1.98,11.65 v1.83,11.6 | C20.1 2.73,12.2 2.23,12.7 v2.13,12.7 | R17.1 6.25,12.75 v6.4,12.7
  Top 0.5: v52.53,19 53.2,18.33 53.2,18 | 54.8,19.6 55,19.6
  Top 0.6: J3.GND 16,22.6 27.6,22.6 v28.1,22.2
  Top 1: 53.2,18 54.8,19.6
  Bottom 0.4: 50.1,6 49.8,6
  Bottom 0.6: TEC/FAN.4 50.1,6 | U1.4 60.45,26.45 60.5,26.5 | 60.5,26.5 58,26.5 | 60.5,26.5 62.5,26.5 | 60.4,25.4 60.4,24.4 | 60.4,24.4 58.4,24.4 | 60.4,24.4 62.4,24.4
  other vias: 10.26,37.84 8.64,37.84 10.5,36.04 6.7,33.96 4.05,28.1 11.79,28.54 14.27,29.46 12.7,25.4 15.24,25.4 17.78,25.4 22.86,25.4 25.4,25.4 33.6,29.46 41.66,34.8 42.93,34.8 43.18,43.18 45.72,43.18 60.71,41.66 60.2,43.69 50.29,44.7 57.66,44.7 13.59,39.88 14.22,44.7 11.43,44.7 7.37,44.7 5.33,41.15 0.76,40.89 1.02,34.54 1.02,28.19 23.5,27.81 30.48,25.4 33.6,27.69 42.34,28.19 46.23,23.88 50.29,41.66 37.97,35.53 30.38,36.78 28.96,35.05 26.02,38.71 23.21,39.02 19.25,35.05 21.19,34.32 17.4,38.25 14.73,36.07 13.57,34.84 15.51,39.69 23.32,35.14 11.71,39.04 5.33,44.7 33.02,43.18 11.86,33.19 6.99,38.73 53.42,31.26 28.43,14.8 29.63,14.8 29.63,15.6 29.63,16.4 28.43,15.8 28.43,16.9 28.43,5.7 29.63,6.2 29.63,7 29.63,7.8 28.43,6.5 28.43,7.3 28.43,8.1 52.53,19.9 51.73,19 51.73,19.9 50.03,15.7 49.63,17.2 50.29,33.53 40.47,27.4 42.34,29.19 38.47,29.6 30.37,27.6 28.47,29.4 30.27,29.4 23.5,29.01 21.09,27.61 21.09,29.21 18.97,29.4 24.62,36.54 40.47,28.9 30.87,34.4 50.42,30.76 59.81,28.52 10.1,34.16 6.7,32.56 6.05,26.1 6.05,28.2 11.79,27.54 30.42,43.18 40.63,25.38 61.31,28.52 62.31,27.52 62.31,26.02 62.31,25.02 62.31,23.52 61.31,22.52 59.31,22.52 57.81,22.52 56.31,22.52 56.31,24.02 56.31,25.52 56.31,27.02 57.81,27.02 57.81,25.52 57.81,24.02 51.81,25.52 51.81,24.02 51.81,22.52 51.81,27.02 51.81,28.52 50.31,27.02 50.31,25.52 50.31,24.02 52.31,21.02 22.82,43.18 13.11,41.89 17.11,41.09 32.77,34.4 14.27,27.56 6.2,36.04 3.9,38.14 3.8,31.84
  pour Bottom (isolate 0.254, rank 6): 0,0 63.5,0 63.5,48.26 0,48.26
  pour Top (isolate 0.25): 25.83,17.4 29.03,17.4 30.03,16.4 30.03,6 29.03,5 25.83,5
  pour Top (isolate 0.254): 49.23,23 49.23,15 52.03,15 arc90 53.53,16.5 53.53,23
  pour Top (isolate 0.254): 0,45.72 0,22.86 12.7,22.86 48,23 52,19 63.5,19 63.5,45.72
INA  (via drill 0.35)
  Top 0.4: 8.72,15.4 U8.4 7.47,15.43 v7.2,15.7
  Bottom 0.4: v7.2,15.7 7.2,17.8 10.7,21.3 13.68,21.3 J3.14
INB  (via drill 0.35)
  Top 0.4: U8.10 7.63,9.43 7.1,8.9 v7.1,8.7
  Bottom 0.4: J3.13 16.92,22.7 16.1,22.7 14,20.6 10.9,20.6 8,17.7 8,9.6 v7.1,8.7
MISO  (via drill 0.3)
  Top 0.3: U3.14 13.83,31.35 | U4.14 23.23,31.35 | v32.67,31.21 33,31.35 U5.14 | U6.14 42.75,31.37 v41.81,31.37
  Top 0.305: 13.83,31.35 v13.34,31.11 | J3.MISO 34.8,25.53 34.04,25.53 32.51,27.05 32.51,30.86 v32.67,31.21 | 23.23,31.35 v22.86,31.32
  Bottom 0.305: v41.81,31.37 41.56,31.11 32.8,31.1 v32.67,31.21 32.5,31.1 23.1,31.1 22.9,31.1 | 22.8,31.1 22.9,31.1 | 22.9,31.1 v22.86,31.32 22.8,31.1 | 22.8,31.1 v13.34,31.11
MOSI  (via drill 0.3)
  Top 0.3: U3.11 13.74,33.3 13.73,33.3 | U4.11 22.96,33.3 | U5.11 32.87,33.3 v32.77,33.4 | U6.11 41.91,33.3 v41.81,33.4
  Top 0.305: 13.73,33.3 v13.34,33.4 | 22.96,33.3 v22.86,33.4 | J3.MOSI 31.88,26.54 31.88,31.88 31.24,32.51 v31.24,33.4
  Bottom 0.305: v41.81,33.4 v32.77,33.4 v31.24,33.4 v22.86,33.4 v13.34,33.4
N$1  (via drill 2.54 pad 4.45)  (2 unrouted)
  other vias: 2.54,25.4 2.54,2.54 2.54,20.32
N$2  (via drill 2.54 pad 4.45)
  other vias: 2.54,43.18
N$4
  Top 0.3: R2.1 18.61,41.76 R3.2
N$5
  Top 0.3: U3.2 U3.1 20.35,30.7 R5.2
  Top 0.305: 20.67,30.7 R5.2
N$6
  Top 0.3: U3.3 U3.4 20.2,32.65 R5.1
N$7
  Top 0.3: U3.20 18.07,28.61 C4.1 FB1.1
N$8
  Top 0.3: U4.1 U4.2 | 28.74,30.7 U4.1 | U4.1 29.76,30.7 R7.2
N$9
  Top 0.3: U4.3 U4.4 29.64,32.65 R7.1
N$10
  Top 0.3: U4.20 27.5,28.83 C7.1 FB2.1
N$11
  Top 0.3: U5.2 U5.1 39.29,30.04 R9.2
N$12
  Top 0.3: U5.4 U5.3 39.3,32 R9.1
N$13
  Top 0.3: FB3.1 C10.1 37.4,28.8 U5.20
N$14
  Top 0.3: U6.2 U6.1 48.13,30.2 R11.2
N$15
  Top 0.3: U6.4 U6.3 | U6.3 | U6.3 48.4,32 48.65,31.75 R11.1
N$16
  Top 0.3: U6.20 46.5,28.27 | 46.5,28.27 C13.1 | FB4.1 46.5,28.02 46.5,28.27
N$20
  Top 0.3: R16.2 7.32,31.27 U7.3
OUTA1  (via drill 0.35)
  Top 0.2: 22.63,19.4 arc-90 22.53,19.5 19.83,19.5 18.03,19.5 arc-90 17.63,19.1 17.63,18.3 | 29.83,20 29.23,18.6
  Top 0.4: v24.43,18 23.21,18 23.21,17.6 | v24.43,16.8 22.77,16.8 22.77,17.16 | v25.03,15 24.53,15 24.53,14.5 23.23,14.5 23.23,14.6
  Top 0.6: U8.25 23.37,13.43 U8.OUTA | 29.83,20 31.43,20 32.38,19.05 L4.1 31.53,17.77 31.53,17.3 30.53,17.3 29.23,18.6 | U8.OUTA 22.63,17.02 22.63,19.4 | U8.OUTA 19.83,16.97 19.83,19.5 | 23.21,17.6 22.77,17.16 U8.OUTA | U8.OUTA 19.2,17.6 18.33,17.6 17.63,18.3
  other vias: 24.43,15.6 25.03,16.2 25.03,17.4 25.03,18.5 28.53,18.4 29.63,18.4 28.53,19.9 29.63,19.9 27.33,19.9 26.23,19.9 25.03,19.9
  pour Top (isolate 0.25, rank 2): 33.53,22.86 7.93,22.86 7.93,17.8 29.13,17.8 29.83,17.1 33.53,17.1
  pour Bottom (isolate 0.25, rank 2): 18.73,20.4 30.03,20.4 30.03,17.8 27.83,17.8 27.83,14.6 18.73,14.6
  pour Top (isolate 0.25, rank 2): 21.23,18.6 25.33,18.6 25.33,12.6 21.23,12.6
OUTB1  (via drill 0.35)
  Top 0.6: U8.21 23.37,9.43 U8.OUTB | 30.53,2.9 31.45,2.9 32.38,3.83 L3.2 31.43,5.08 31.43,5.4 30.43,5.4 29.43,4.4 | U8.OUTB 21.2,6.33 22.63,4.9 22.63,3.4 | U8.OUTB 21.2,5.97 19.73,4.5 19.73,3.5 | U8.OUTB 23.27,5.2 24.03,5.2 24.83,4.4 | U8.OUTB 19.14,5.2 18.48,5.2 17.68,4.4
  other vias: 24.53,9.9 25.03,9.3 24.53,8.7 25.03,8.1 24.53,7.5 25.03,6.9 24.53,6.3 25.03,5.7 24.43,5.1 25.03,4.6 28.43,4.2 28.43,3.2 27.53,3.2 29.33,3.2 29.33,4.2 30.23,4.2 30.23,3.2 26.63,3.2 25.03,3.2 24.03,3.2 23.03,3.2 21.93,3.2 20.93,3.2 19.93,3.2 18.93,3.2 17.93,3.2 16.93,3.2 15.83,3.2 14.83,3.2 13.83,3.2 12.73,3.2 11.63,3.2 10.53,3.2
  pour Top (isolate 0.25, rank 2): 33.53,0 4.33,0 4.43,6.7 8.03,6.7 9.03,4.8 29.43,4.8 30.23,5.6 33.53,5.6
  pour Bottom (isolate 0.25, rank 2): 10.08,11.05 27.73,11.05 27.73,5 30.73,5 30.73,2.65 10.08,2.65
  pour Top (rank 2): 25.43,10.3 18.63,10.3 18.63,4.6 25.43,4.6
PWM  (via drill 0.3, 0.35, 0.4)
  Top 0.3: J3.5 26.76,42 23.6,42 22.7,41.1 22.7,39.6 21.9,38.8 v18.9,38.8 | 5.2,24.9 5.2,29 5.1,29.1 5.1,33.8 6.3,35 11,35 v14.8,38.8
  Top 0.4: 8.78,12.4 U8.7 7.67,12.43 6.4,13.7 v4.6,13.7 3.96,13.36 R17.2 | v5.2,22.2 4.9,23.9 5,24.5 5.2,24.9
  Bottom 0.3: v18.9,38.8 17.71,38.8 17.65,38.86 17.15,38.86 17.09,38.8 v14.8,38.8
  Bottom 0.4: v4.6,13.7 4.6,18.4 5.2,19 v5.2,22.2
RTDIN1+  (via drill 0.3)
  Top 0.3: U3.7 17.41,34.94
  Top 0.305: 17.41,34.94 v17.78,35.31 17.78,35.69 C5.1 | v58.55,37.78 58.86,37.47 RTD1.4
  Bottom 0.305: v17.78,35.31 18.28,35.31 23.49,40.51 43.21,40.51 43.44,40.74 44.09,40.74 44.83,40.01 53.47,40.01 57.98,37.78 v58.55,37.78
RTDIN1-  (via drill 0.3)
  Top 0.3: U3.8 v16.77,35.41 v16.76,35.41
  Top 0.305: C5.2 v16.76,35.41 | RTD1.2 v58.42,38.73
  Bottom 0.305: v16.76,35.41 17.36,36.01 18.16,36.01 23.18,41.02 42.94,41.02 43.25,41.33 44.35,41.33 44.4,41.27 45.09,40.64 45.21,40.51 53.72,40.51 57.53,38.73 v58.42,38.73
RTDIN2+  (via drill 0.3, 0.36)
  Top 0.3: U4.7 26.85,34.98 v27.18,35.31 27.18,36.32 C8.1
  Top 0.305: v58.61,35.5 59.18,34.92 RTD1.8
  Bottom 0.305: v27.18,35.31 30.35,38.48 52.7,38.48 57.72,35.5 v58.61,35.5
RTDIN2-  (via drill 0.3, 0.36)
  Top 0.3: v26.16,35.41 26.2,35.37 U4.8
  Top 0.305: C8.2 25.65,36.43 26.16,36.12 v26.16,35.41 | v58.55,36.26 58.74,36.2 RTD1.6
  Bottom 0.305: v26.16,35.41 29.75,38.99 52.96,38.99 57.72,36.26 v58.55,36.26
RTDIN3+  (via drill 0.3)
  Top 0.3: U5.7 36.75,35.45 v36.8,35.51 36.8,36.08
  Top 0.305: C11.1 36.8,36.08 | RTD1.12 58.67,32.38 v58.55,32.45
  Bottom 0.305: v36.8,35.51 36.8,35.66 37.59,36.45 51.69,36.45 57.72,32.45 v58.55,32.45
RTDIN3-  (via drill 0.3)
  Top 0.3: 36.07,35.61 v36.04,35.65 | U5.8 36.1,35.05 36.1,35.56 36.1,35.58 36.07,35.61 | 36.07,36.12 36.07,35.61
  Top 0.305: C11.2 36.07,36.12 | v58.55,33.21 59.31,33.66 RTD1.10
  Bottom 0.305: v36.04,35.65 36.09,35.96 37.08,36.96 51.94,36.96 57.72,33.21 v58.55,33.21
RTDIN4+
  Top 0.3: 45.86,35.27 45.85,35.05 U6.7
  Top 0.305: C14.1 45.86,35.72 45.86,35.27 46.1,35.31 47.37,35.31 48.87,33.37 50.38,32.39 51.94,29.74 53.7,28.96 58.61,28.96 59.5,29.84 RTD1.16
RTDIN4-  (via drill 0.3)
  Top 0.3: v45.21,35.31 45.2,35.29 U6.8
  Top 0.305: C14.2 45.21,35.71 v45.21,35.31 | v58.48,30.92 58.67,31.11 RTD1.14
  Bottom 0.305: v45.21,35.31 51.31,35.31 57.72,30.92 v58.48,30.92
SCLK  (via drill 0.3)
  Top 0.3: v32.77,32.64 v32.78,32.65 U5.12 | U6.12 v41.82,32.65 v41.81,32.64
  Top 0.305: v13.34,32.64 14.41,32.64 14.4,32.65 U3.12 | U4.12 v22.86,32.64 | J3.SCK 31.24,24.64 31.24,31.5 v30.99,31.75 | U4.12 | U4.12 23.81,32.64
  Bottom 0.305: v41.81,32.64 v32.77,32.64 30.99,32.64 | 30.99,32.64 v22.86,32.64 v13.34,32.64 | 30.99,32.64 v30.99,31.75
SIO
  Top 0.3: R3.1 20,40.7 20.3,41 21.3,41 21.64,41.34 U2.1
  Top 0.305: 21.4,41.84 U2.1 22.67,41.84 23.5,42.67 24.89,42.67 J3.6
SNUB1
  pour Top (no thermals): 43.98,13.25 43.98,9.5 41.98,9.5 41.98,13.25
TECM
  Top 0.4: 50.5,8.6 49.8,8.6 | 50.3,6.2 50,6.2
  Top 0.5: 50.5,8.6 TEC/FAN.3 50.3,6.2
  Top 0.6: C21.1 46.33,11 | 46.33,11 47.53,9.8 47.53,8.4 | 45.13,8.3 45.13,9.8 46.33,11 | 40.63,3.2 39.51,3.2 L3.1 39.76,5.3 40.63,5.3 40.63,5.9 41.43,6.7 44.13,6.7
  pour Top: 37.98,4.7 39.28,6 42.52,6 45.23,9.2 45.73,10.2 45.73,9.8 47.03,9.8 48.08,9.05 51.63,8.65 51.63,6.3 46.83,5.3 44.53,3 37.98,3
TECP
  Top 0.2: 40.83,19.8 arc90 40.93,19.7 40.93,17.1 | 45.65,17.73 arc90 44.83,17.55 D4.A
  Top 0.4: 53.43,8.67 53.43,9.7 | 55.8,8.7 55.8,9.4
  Top 0.5: 53.43,8.67 TEC/FAN.1 55.8,8.7
  Top 0.6: C21.2 51.63,10.3 51.63,9.8 51.53,9.7 53.43,9.7 | C21.2 51.78,10.9 53.03,10.9 | C21.2 51.63,13.4 52.93,13.4 53.03,13.3 | 40.83,19.8 39.76,19.8 L4.2 40.1,17.1 40.93,17.1 | 53.03,12.3 51.78,12.3
  Top 0.7: 51.26,13.47 49.6,13.47 | 51.43,10.1 50.03,10.1 | C21.2 51.4,11.8 49.76,11.85 49.6,12.4
  Top 1: 49.6,13.72 49.6,13.47 | 51.63,13.4 51.26,13.47 | 50.03,10.1 49.6,10.72 | 51.63,10.3 51.43,10.1
  Top 1.5: 49.6,13.72 49.33,14 48.23,15.9 45.65,17.73 | 49.6,13.47 49.6,12.4 49.6,10.72
  pour Top: 37.98,18.25 39.48,16.75 46.38,16.75 46.38,18.15 44.23,20 37.98,20
  pour Top: 52.33,14.3 56.03,10.7 56.03,7 55.33,6.3 53.73,6.3 53.73,7.9 52.43,9.6 51.03,9.6 51.03,14.3
VCC  (via drill 0.35)
  Top 0.4: U8.VCC 14.26,8.82
  Top 0.6: U8.13 11.86,6.43 14.26,8.82 | U8.3 11.7,16.43 14.26,13.88 U8.VCC 18.3,11.43 U8.23
  other vias: 10.43,10 10.93,10.6 10.43,11.2 10.93,11.8 10.93,13 10.43,13.7 10.93,14.4 10.43,15.1 10.93,15.8 10.43,16.5 11.03,17.1 17.13,7.3 17.13,8 17.13,8.7 12.03,17.1 13.03,17.1 14.03,17.1 15.03,17.1 16.13,17.1 17.23,17.1 17.13,11.1 17.13,12.7 17.13,13.95 17.13,15.2 17.13,5.6 16.13,5.6 15.13,5.6 14.13,5.6 13.13,5.6 12.13,5.6 10.43,5.6 11.23,5.6 10.43,12.4
  pour Bottom: 17.53,18.7 17.53,5.2 9.23,5.2 9.23,18.7
  pour Top (rank 3, no thermals): 17.53,17.5 17.53,4 10.13,4 10.13,17.5
VHOST
  Bottom 0.5: D1.C 4.95,38.35 9.4,42.8 19.94,42.8 J3.USB
VIN  (via drill 0.35)
  Top 0.4: U8.12 10.26,7.43 v11.13,8.3
  Bottom 0.3: 54.85,21.01 C1.P$2
  Bottom 0.4: v11.13,8.3 12.23,9.4 17.93,9.4 20.03,11.5 20.03,13.2 19.96,13.27 Q3.3 20.23,13.27 | 20.23,15.8 18,15.8 | 19.73,14.5 18.33,14.5
  Bottom 0.5: 20.23,16 20.23,15.8 | 18,14.54 18.33,14.5 | 20.23,13.5 20.23,13.27 | 45.73,13.1 45.43,13.1 | U10.5 39.9,12.39 40.2,12.6 | U10.6 41.16,12.44 41.2,12.6 | U10.7 42.4,10.81 42.4,12.4 | U10.8 43.7,12.51 43.8,12.6
  Bottom 0.6: 54.6,14 53.73,14 | 56.23,16.5 PWR.1 53.46,16.5 | 32.6,13.8 33.96,15.16 C23.P$2 C22.P$2 40.04,15.16 41.2,14
  Bottom 0.7: C23.P$2 35.67,13.47 35.6,13.4 | C22.P$2 38.4,15.13 38.4,13.6
  Bottom 1: PWR.1 55.56,17.38 C1.P$2 54.15,21.61 U1.1
  pour Bottom: 18.03,11.93 18.03,16.6 21.03,16.6 22.93,14.2 51.63,14.2 53.13,16.7 56.43,16.6 56.43,13.43 arc-90 54.43,11.93
VREGHOST  (via drill 0.35)
  Top 0.4: R21.2 v3.08,9 | v3.08,14.63 3.38,14.93 R20.2
  Top 0.5: R20.2 3.96,16.99 6.6,19.64 6.6,21.2 8.89,23.49
  Top 0.6: J3.3V3 8.89,23.49
  Bottom 0.4: v3.08,14.63 v3.08,9

### Text on the board
tPlace: Capable Robot Components / SenseTemp TEC [CR2ERP] | RTD4
bPlace: 5V | SIO | PWM | 1 | 2 | 3 | 4 | Capable Robot Components / SenseTemp TEC [CR2ERP] | 1 | 2 | 3 | 4 | 3v3 | GND | INA | INB | ENB | ENA | FB | SCLK | MOSI | MISO | STAT | CTRL | GND | 12V | SUPPLY | TEC | - | + | GND | FAN